# Altium schematic sheet BLDC-CONTROLLET.SchDoc
size 420 x 297 mm; ApprovedBy: Бакан; CheckedBy: Зарецкий; DrawnBy: Войтенко; DocumentNumber: АБВГ.000000.000 Э3; SheetNumber: 1; SheetTotal: 5; PageSetup: Record=PageOptions|CenterHorizontal=False|CenterVertical=False|PrintScale=0.95|XCorrection=0.00|YCorrection=0.00|PrintKind=1|BorderSize=5000000|LeftOffset=0|BottomOffset=0|Orientation=1|PaperLength=1000|PaperWidth=1000|Scale=100|PaperSource=15|PrintQuality=600|MediaType=1|DitherType=10|PaperKind=A4|PrintScaleMode=1; DocumentType: Схема электрическая принципиальная; Developer1size1str: ООО ЛАЦИТ; Title1size1str: Плата контроллера
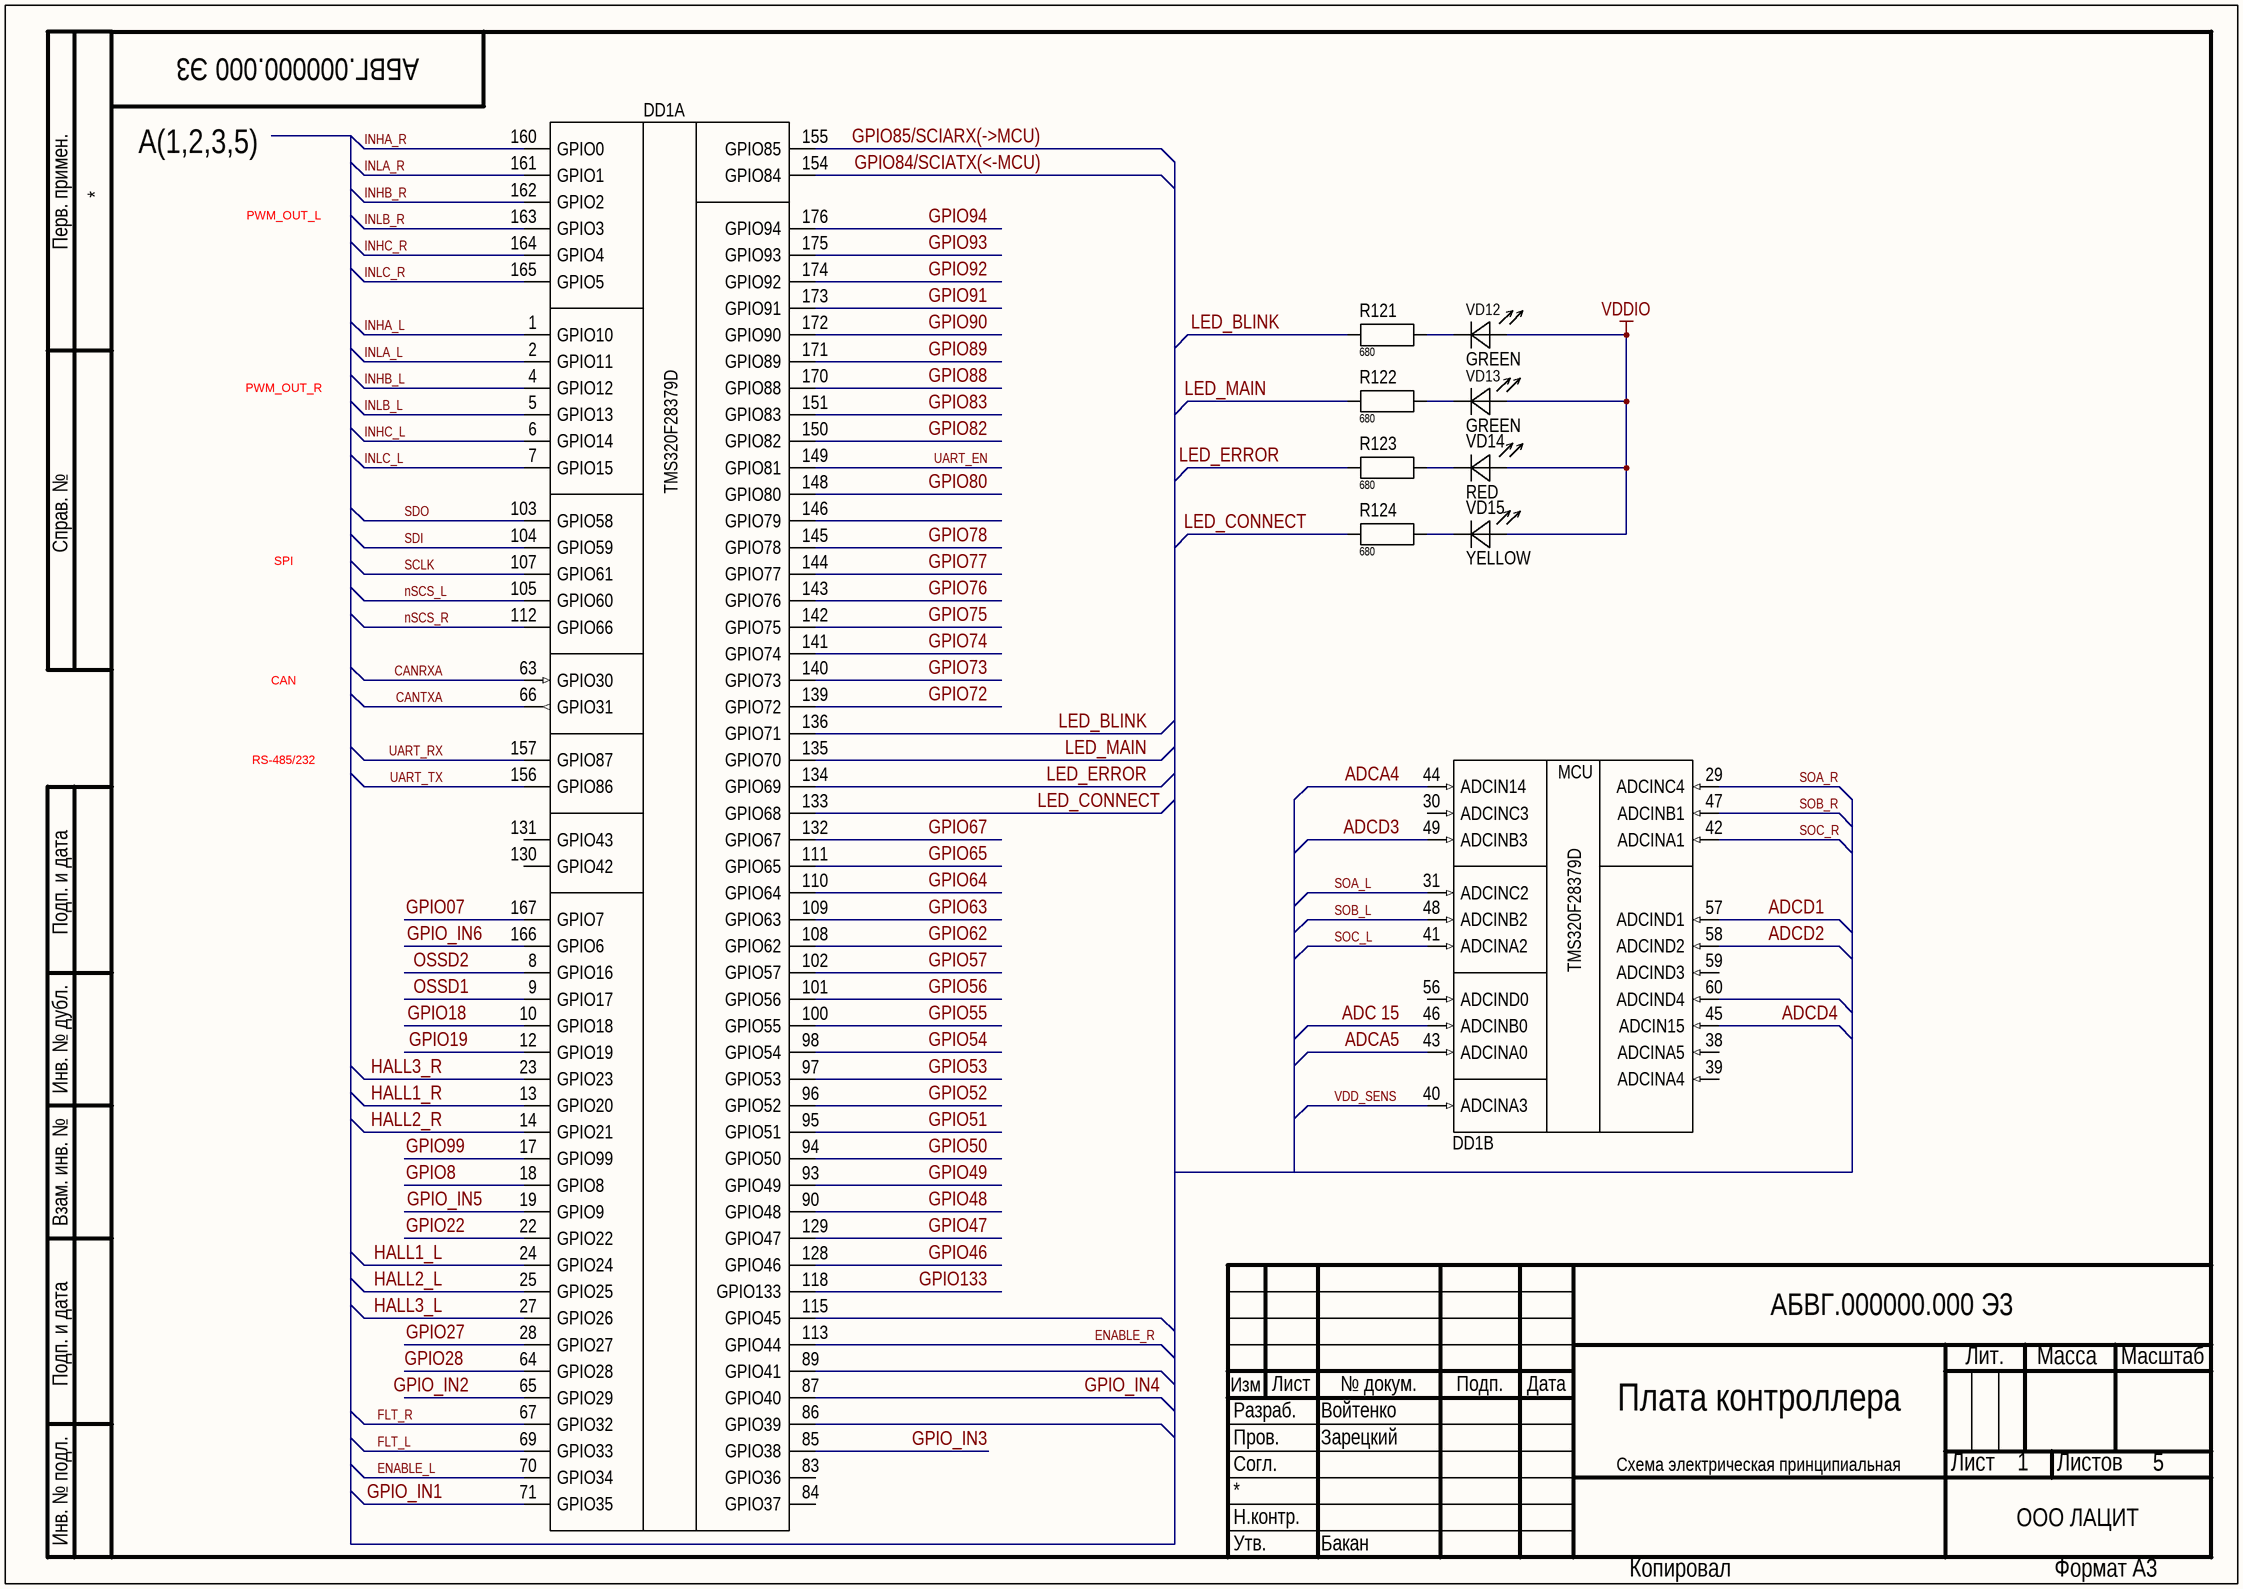
[diagram p0: BLDC-CONTROLLET.SchDoc]

## Parts
DD1  TMS320F28379DPTP_LACID  [176-HLQFP]  (value not drawn)  (parts A,B of 3)
R121  680  [RES: 0402]
R122  680  [RES: 0402]
R123  680  [RES: 0402]
R124  680  [RES: 0402]
VD12  value GREEN  [LED: 0402G]  (hidden comment: Led 0402 GREEN)
VD13  value GREEN  [LED: 0402G]  (hidden comment: Led 0402 GREEN)
VD14  value RED  [LED: 0402R]  (hidden comment: Led 0402 RED)
VD15  value YELLOW  [LED: 0402Y]  (hidden comment: Led 0402 YELLOW)

## Nets
VDDIO: VD12.1 VD13.1 VD14.1 VD15.1
ADC 15: DD1.46(ADCINB0)
ADCA4: DD1.44(ADCIN14)
ADCA5: DD1.43(ADCINA0)
ADCD1: DD1.57(ADCIND1)
ADCD2: DD1.58(ADCIND2)
ADCD3: DD1.49(ADCINB3)
ADCD4: DD1.45(ADCIN15)
CANRXA: DD1.63(GPIO30)
CANTXA: DD1.66(GPIO31)
ENABLE_L: DD1.70(GPIO34)
ENABLE_R: DD1.113(GPIO44)
FLT_L: DD1.69(GPIO33)
FLT_R: DD1.67(GPIO32)
GPIO07: DD1.167(GPIO7)
GPIO8: DD1.18(GPIO8)
GPIO18: DD1.10(GPIO18)
GPIO19: DD1.12(GPIO19)
GPIO22: DD1.22(GPIO22)
GPIO27: DD1.28(GPIO27)
GPIO28: DD1.64(GPIO28)
GPIO46: DD1.128(GPIO46)
GPIO47: DD1.129(GPIO47)
GPIO48: DD1.90(GPIO48)
GPIO49: DD1.93(GPIO49)
GPIO50: DD1.94(GPIO50)
GPIO51: DD1.95(GPIO51)
GPIO52: DD1.96(GPIO52)
GPIO53: DD1.97(GPIO53)
GPIO54: DD1.98(GPIO54)
GPIO55: DD1.100(GPIO55)
GPIO56: DD1.101(GPIO56)
GPIO57: DD1.102(GPIO57)
GPIO62: DD1.108(GPIO62)
GPIO63: DD1.109(GPIO63)
GPIO64: DD1.110(GPIO64)
GPIO65: DD1.111(GPIO65)
GPIO67: DD1.132(GPIO67)
GPIO72: DD1.139(GPIO72)
GPIO73: DD1.140(GPIO73)
GPIO74: DD1.141(GPIO74)
GPIO75: DD1.142(GPIO75)
GPIO76: DD1.143(GPIO76)
GPIO77: DD1.144(GPIO77)
GPIO78: DD1.145(GPIO78)
GPIO80: DD1.148(GPIO80)
GPIO82: DD1.150(GPIO82)
GPIO83: DD1.151(GPIO83)
GPIO84/SCIATX(<-MCU): DD1.154(GPIO84)
GPIO85/SCIARX(->MCU): DD1.155(GPIO85)
GPIO88: DD1.170(GPIO88)
GPIO89: DD1.171(GPIO89)
GPIO90: DD1.172(GPIO90)
GPIO91: DD1.173(GPIO91)
GPIO92: DD1.174(GPIO92)
GPIO93: DD1.175(GPIO93)
GPIO94: DD1.176(GPIO94)
GPIO99: DD1.17(GPIO99)
GPIO133: DD1.118(GPIO133)
GPIO_IN1: DD1.71(GPIO35)
GPIO_IN2: DD1.65(GPIO29)
GPIO_IN3: DD1.85(GPIO38)
GPIO_IN4: DD1.87(GPIO40)
GPIO_IN5: DD1.19(GPIO9)
GPIO_IN6: DD1.166(GPIO6)
HALL1_L: DD1.24(GPIO24)
HALL1_R: DD1.13(GPIO20)
HALL2_L: DD1.25(GPIO25)
HALL2_R: DD1.14(GPIO21)
HALL3_L: DD1.27(GPIO26)
HALL3_R: DD1.23(GPIO23)
INHA_L: DD1.1(GPIO10)
INHA_R: DD1.160(GPIO0)
INHB_L: DD1.4(GPIO12)
INHB_R: DD1.162(GPIO2)
INHC_L: DD1.6(GPIO14)
INHC_R: DD1.164(GPIO4)
INLA_L: DD1.2(GPIO11)
INLA_R: DD1.161(GPIO1)
INLB_L: DD1.5(GPIO13)
INLB_R: DD1.163(GPIO3)
INLC_L: DD1.7(GPIO15)
INLC_R: DD1.165(GPIO5)
LED_BLINK: DD1.136(GPIO71) R121.1
LED_CONNECT: DD1.133(GPIO68) R124.1
LED_ERROR: DD1.134(GPIO69) R123.1
LED_MAIN: DD1.135(GPIO70) R122.1
nSCS_L: DD1.105(GPIO60)
nSCS_R: DD1.112(GPIO66)
OSSD1: DD1.9(GPIO17)
OSSD2: DD1.8(GPIO16)
SCLK: DD1.107(GPIO61)
SDI: DD1.104(GPIO59)
SDO: DD1.103(GPIO58)
SOA_L: DD1.31(ADCINС2)
SOA_R: DD1.29(ADCINC4)
SOB_L: DD1.48(ADCINB2)
SOB_R: DD1.47(ADCINB1)
SOC_L: DD1.41(ADCINA2)
SOC_R: DD1.42(ADCINA1)
UART_EN: DD1.149(GPIO81)
UART_RX: DD1.157(GPIO87)
UART_TX: DD1.156(GPIO86)
VDD_SENS: DD1.40(ADCINA3)
NetR121_2: R121.2 VD12.2
NetR122_2: R122.2 VD13.2
NetR123_2: R123.2 VD14.2
NetR124_2: R124.2 VD15.2

Not connected (* = marked no-connect by the designer): DD1 30(ADCINC3) 38(ADCINA5) 39(ADCINA4) 56(ADCIND0) 59(ADCIND3) 60(ADCIND4) 83(GPIO36) 84(GPIO37) 86(GPIO39) 89(GPIO41) 115(GPIO45) 130(GPIO42) 131(GPIO43) 146(GPIO79)

## Notes on the sheet
- А(1,2,3,5)
- PWM_OUT_L
- PWM_OUT_R
- SPI
- CAN
- RS-485/232
- Перв. примен.
- Справ. №
- Подп. и дата
- Инв. № дубл.
- Взам. инв. №
- Изм
- Лист
- № докум.
- Подп.
- Дата
- Лит.
- Масса
- Масштаб
- Пров.
- Согл.
- Разраб.
- Листов
- Инв. № подл.
- Н.контр.
- Утв.
- Копировал
- Формат А3
- (in symbol TMS320F28379DPTP_LACID, part A) TMS320F28379D
- (in symbol TMS320F28379DPTP_LACID, part B) MCU; TMS320F28379D

## Library data of the parts
DD1 = TMS320F28379DPTP_LACID: PartNumber: TMS320F28379DPTPT; Case: HLQFP-176
R121-R124 = RES 0402: PartNumber: RC0402FR-07680RL; Value: 680; Case: 0402